# EAGLE design hrem (EAGLE 7.6.0)
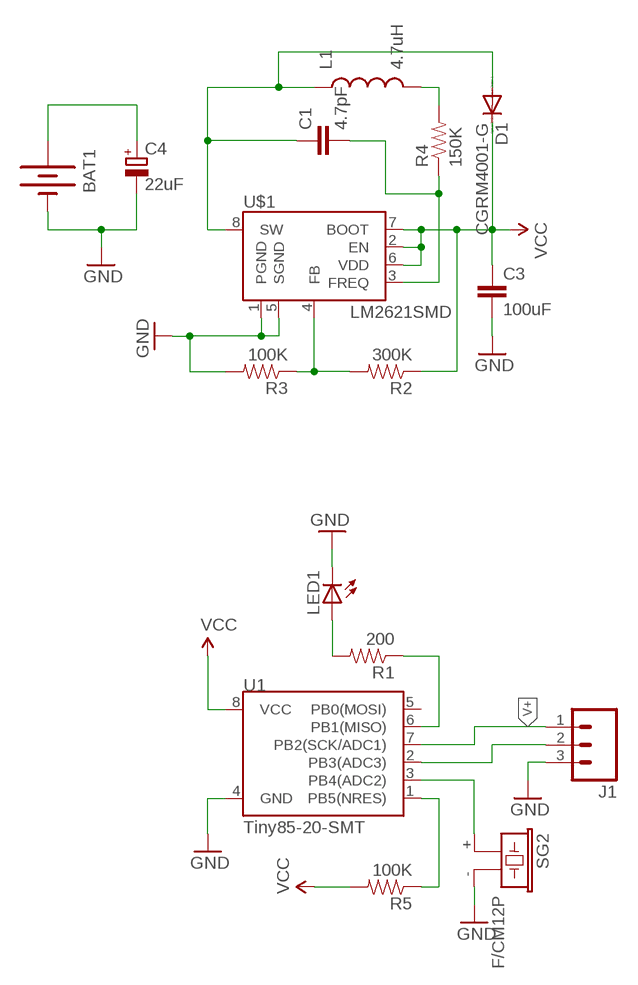
[diagram p0: schematic, sheet 1]

## Parts
BAT1  BATTERYAAA  [BATTERY-AAA]
C1  4.7pF  C-EUC1206  [C1206]
C3  100uF  C-EUC1206  [C1206]
C4  22uF  CPOL-EUE2.5-5  [E2,5-5]
D1  CGRM4001-G  [SOD-123_MINI-SMA]
J1  M03PTH  [1X03]
L1  4.7uH  INDUCTORCR54-47UH  [CR54]
LED1  LED3MM  [LED3MM]
R1  200  RESISTOR1206  [1206]
R2  300K  RESISTOR1206  [1206]
R3  100K  RESISTOR1206  [1206]
R4  150K  RESISTOR1206  [1206]
R5  100K  RESISTOR1206  [1206]
SG2  F/CM12P  [F/CM12P]
U1  Tiny85-20-SMT  ATTINY45TINY85-20-SMT  [SO08-EIAJ]
U$1  LM2621SMD  [MSOP-8]

## Nets
GND: BAT1.GND@1(-) C3.2 C4.- J1.3 LED1.K(C) R3.2 SG2.- U1.4(GND) U$1.1(PGND) U$1.5(SGND)
N$1: LED1.A R1.2
N$2: R5.1 U1.1(PB5(NRES))
N$3: SG2.+ U1.3(PB4(ADC2))
N$5: J1.2 U1.2(PB3(ADC3))
N$8: R1.1 U1.6(PB1(MISO))
N$9: C1.1 D1.A L1.P$1 U$1.8(SW)
N$10: L1.P$2 R4.2
N$11: C1.2 R4.1 U$1.3(FREQ)
N$12: R2.2 R3.1 U$1.4(FB)
N$15: BAT1.PWR@1(+) C4.+
V+: J1.1 U1.7(PB2(SCK/ADC1))
VCC: C3.1 D1.C R2.1 R5.2 U1.8(VCC) U$1.2(EN) U$1.6(VDD) U$1.7(BOOT)
Unconnected: U1.5(PB0(MOSI))

## Library data of the parts
BAT1 = SparkFun-Electromechanical:BATTERY: Battery Holders Various common sizes : AA, AAA, 18650 (PRT-12895), 20mm coin cell and 12mm coin cell. 20MM_4LEGS, BATT-10373; PROD_ID: BATT-08571
C1 C3 = rcl:C-EU: CAPACITOR, European symbol
C4 = rcl:CPOL-EU: POLARIZED CAPACITOR, European symbol
D1 = diode:CGRM400*-G: Molded plasitc,JEDEC SOD-123/Mini SMA Source: Comchip CGRM4001-G.pdf
J1 = SparkFun-Connectors:M03: Header 3 Standard 3-pin 0.1" header. Use with straight break away headers (SKU : PRT-00116), right angle break away headers (PRT-00553), swiss pins (PRT-00743), machine pins (PRT-00117), and female headers (PRT-00115). Molex polarized connector foot print use with SKU : PRT-08232 with associated crimp pins and housings.
L1 = SparkFun-Passives:INDUCTOR: Inductors Basic Inductor/Choke - 0603 and 1206. Footprints are not proven and vary greatly between part numbers. INDUCTOR POWER 3.3UH 4.0A SMD 0.197" L x 0.197" W x 0.177" H (5.00mm x 5.00mm x 4.50mm); PROD_ID: NDUC-10789; VALUE: 47uH
LED1 = led:LED: LED OSRAM: - CHIPLED LG R971, LG N971, LY N971, LG Q971, LY Q971, LO R971, LY R971 LH N974, LH R974 LS Q976, LO Q976, LY Q976 LO Q996 - Hyper CHIPLED LW Q18S LB Q993, LB Q99A, LB R99A - SideLED LS A670, LO A670, LY A670, LG A670, LP A670 LB A673, LV A673, LT A673, LW A673 LH A674 LY A675 LS A676, LA A676, LO A676, LY A676, LW A676 LS A679, LY A679, LG A679 - Hyper Micro SIDELED® LS Y876, LA Y876, LO Y876, LY Y876 LT Y87S - SmartLED LW L88C, LW L88S LB L89C, LB L89S, LG L890 LS L89K, LO L89K, LY L89K LS L896, LA L896, LO L896, LY L896 - TOPLED LS T670, LO T670, LY T670, LG T670, LP T670 LSG T670, LSP T670, LSY T670, LOP T670, LYG T670 LG T671, LOG T671, LSG T671 LB T673, LV T673, LT T673, LW T673 LH T674 LS T676, LA T676, LO T676, LY T676, LB T676, LH T676, LSB T676, LW T676 LB T67C, LV T67C, LT T67C, LS T67K, LO T67K, LY T67K, LW E67C LS E67B, LA E67B, LO E67B, LY E67B, LB E67C, LV E67C, LT E67C LW T67C LS T679, LY T679, LG T679 LS T770, LO T770, LY T770, LG T770, LP T770 LB T773, LV T773, LT T773, LW T773 LH T774 LS E675, LA E675, LY E675, LS T675 LS T776, LA T776, LO T776, LY T776, LB T776 LHGB T686 LT T68C, LB T68C - Hyper Mini TOPLED® LB M676 - Mini TOPLED Santana® LG M470 LS M47K, LO M47K, LY M47K Source: http://www.osram.convergy.de LUXEON: - LUMILED® LXK2-PW12-R00, LXK2-PW12-S00, LXK2-PW14-U00, LXK2-PW14-V00 LXK2-PM12-R00, LXK2-PM12-S00, LXK2-PM14-U00 LXK2-PE12-Q00, LXK2-PE12-R00, LXK2-PE12-S00, LXK2-PE14-T00, LXK2-PE14-U00 LXK2-PB12-K00, LXK2-PB12-L00, LXK2-PB12-M00, LXK2-PB14-N00, LXK2-PB14-P00, LXK2-PB14-Q00 LXK2-PR12-L00, LXK2-PR12-M00, LXK2-PR14-Q00, LXK2-PR14-R00 LXK2-PD12-Q00, LXK2-PD12-R00, LXK2-PD12-S00 LXK2-PH12-R00, LXK2-PH12-S00 LXK2-PL12-P00, LXK2-PL12-Q00, LXK2-PL12-R00 Source: www.luxeon.com KINGBRIGHT: KA-3528ASYC Source: www.kingbright.com
R1-R5 = SparkFun-Resistors:RESISTOR: Resistor Basic schematic elements and footprints for 0603, 1206, and PTH resistors.
SG2 = buzzer:F/CM12P: BUZZER Source: Buerklin; OC_FARNELL: unknown; OC_NEWARK: unknown
U1 = SparkFun-DigitalIC:ATTINY45: Atmel 8-pin 2/4/8kB flash uC; PROD_ID: IC-09092
U$1 = SparkFun-PowerIC:LM2621: Step-up switching regulator IC

## Net classes
0 default: width 0.762 mm, clearance 0.381 mm

## Board
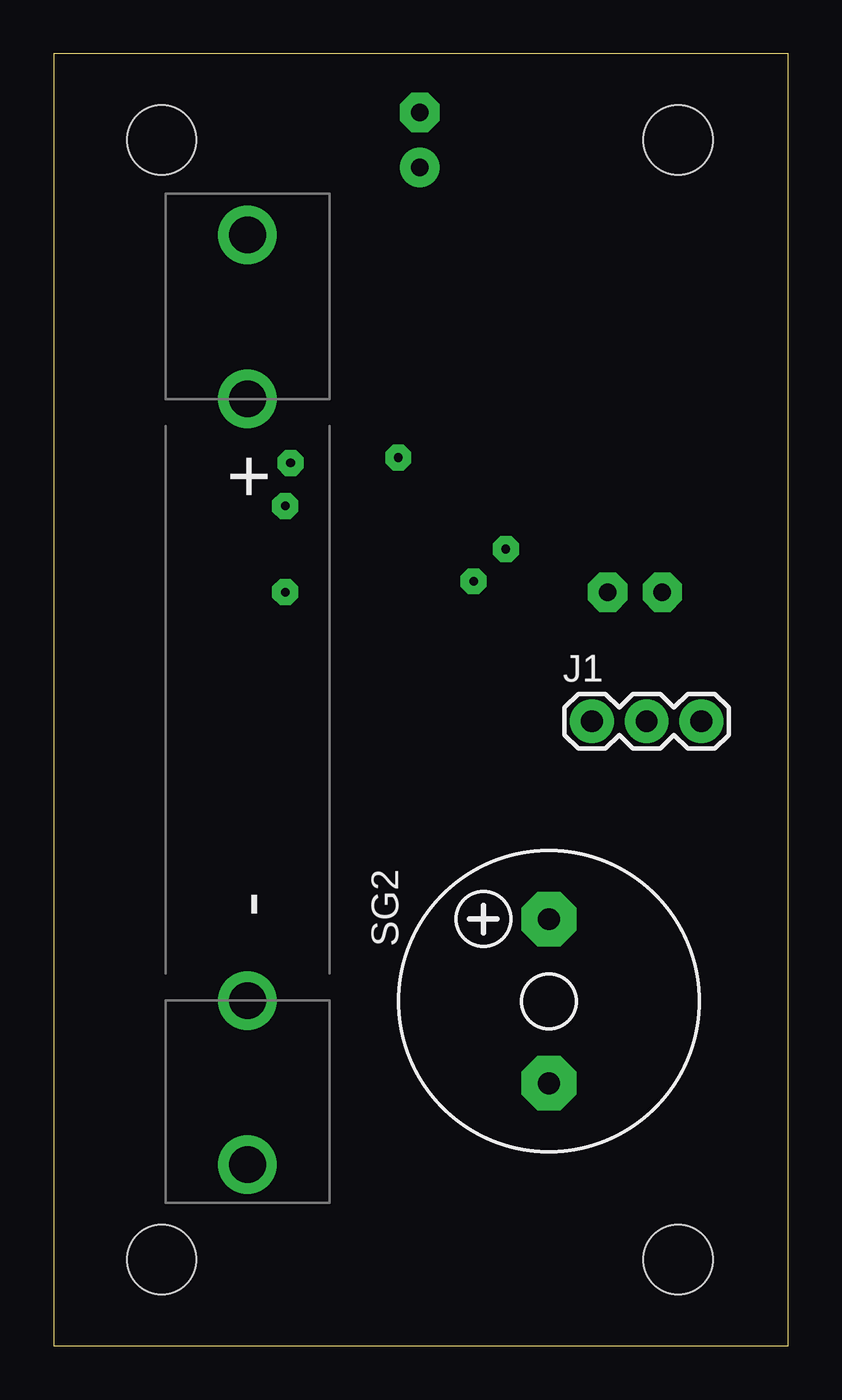
[diagram p1: board, top side]
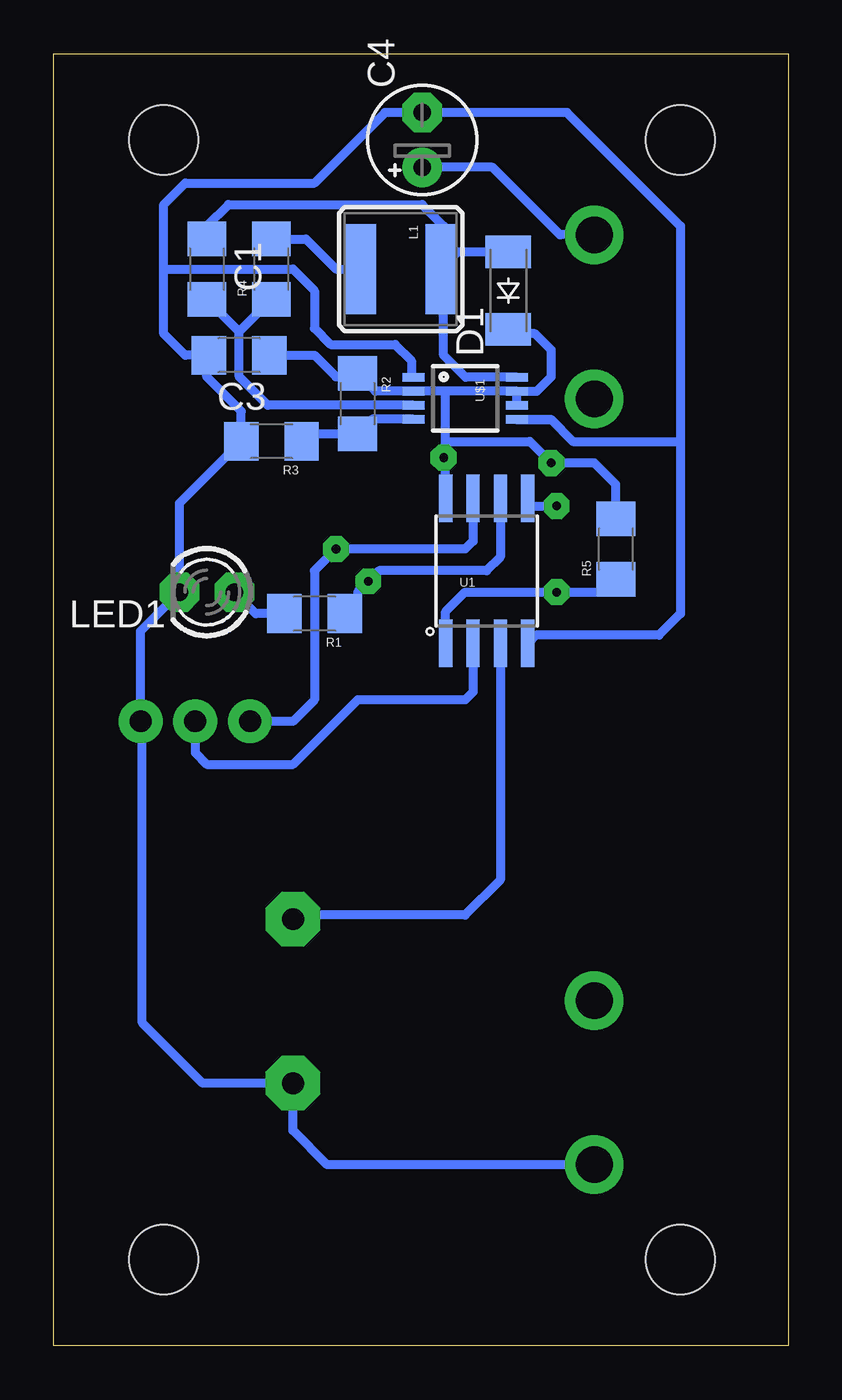
[diagram p2: board, bottom side, seen from below]

Size 34.11 x 60 mm. Coordinates in mm from the lower left corner, seen from the top.
Outline: 0,0 34.11,0 34.11,60 0,60 0,0
Copper layers (1*16): Top 0.035mm / dielectric 1.5mm / Bottom 0.035mm
Design rules "default *": minimum track width 15mil, minimum drill 24mil, track to track 10mil, track to pad 10mil, pad to pad 10mil, via to via 10mil, smd to smd 10mil, copper to edge 40mil, drill to drill 8mil, minimum pad ring 10mil, minimum via ring 8mil, stop-mask expansion 4mil, vias tented up to drill 0mil, thermal gap 10mil
Holes 3.2 mm at 5,4 29,4 5,56 29,56

### Footprints (pad centres in the part's own frame; a part is rotated, then mirrored left to right if it is on the bottom)
BATTERY-AAA = drill 1.702: GND@1 21.59,0; GND@2 13.97,0; PWR@1 -21.59,0; PWR@2 -13.97,0
C1206 = smd 1.6 x 1.8: 1 -1.4,0; 2 1.4,0
E2,5-5 = drill 0.813 pad 1.6: + -1.27,0 | drill 0.813 pad 1.6 octagon: - 1.27,0
SOD-123_MINI-SMA = smd 1.5 x 2.1: A 1.8,0; C -1.8,0
1X03 = drill 1.016 pad 1.88: 1 0,0; 2 2.54,0; 3 5.08,0
CR54 = smd 4.2 x 1.4: P$1 0,1.85; P$2 0,-1.85
LED3MM = drill 0.813 octagon: A -1.27,0; K 1.27,0
1206 = smd 1.6 x 1.8: 1 -1.4,0; 2 1.4,0
F/CM12P = drill 1.016 pad 2.54 octagon: + 3.81,0; - -3.81,0
SO08-EIAJ = smd 0.61 x 2.21: 1 -1.905,-3.378; 2 -0.635,-3.378; 3 0.635,-3.378; 4 1.905,-3.378; 5 1.905,3.353; 6 0.635,3.353; 7 -0.635,3.353; 8 -1.905,3.353
MSOP-8 = smd 0.41 x 1.02: 1 -0.975,-2.4; 2 -0.325,-2.4; 3 0.325,-2.4; 4 0.975,-2.4; 5 0.975,2.4; 6 0.325,2.4; 7 -0.325,2.4; 8 -0.975,2.4

### Placement (x,y rotation side)
BAT1  9,30 270 top
C1  27,50 270 bottom
C3  25.5,46 180 bottom
C4  17,56 90 bottom
D1  13,49 90 bottom
J1  25,29 0 top
L1  18,50 270 bottom
LED1  27,35 180 bottom
R1  22,34 180 bottom
R2  20,43.75 270 bottom
R3  24,42 180 bottom
R4  24,50 90 bottom
R5  8,37 90 bottom
SG2  23,16 90 top
U1  14,36 0 bottom
U$1  15,44 270 bottom

### Tracks (layer width: path | path; a pad name or v marks a point on that pad's centre or on a via)
GND
  Bottom 0.406: BAT1.GND@1 21.41,8.41 23,10 SG2.- 27.19,12.19 30,15 30,28.92 J1.3 30.08,33.19 LED1.K 28.27,39.13 R3.2 25.4,43.4 27,45 27,45.9 | 11,43 12.57,43 U$1.5 11.03,43.02 10,42 5,42 | 27,45.9 C3.2 | 27,45.9 27,46 28,46 29,47 29,50 | 29,50 23,50 22,49 22,47.25 21.25,46.5 18.25,46.5 17.5,45.75 17.5,45.08 U$1.1 | 29,50 29,53 28,54 22,54 18.73,57.27 C4.- 10.27,57.27 5,52 5,42 | 5,42 5,34 6,33 11.72,33 U1.4
N$1
  Bottom 0.406: R1.2 24.73,34 LED1.A
N$2  (via drill 0.4)
  Bottom 0.406: U1.1 15.9,34.09 15,35 v10.75,35 8.6,35 R5.1
N$3
  Bottom 0.406: U1.3 13.37,21.64 15,20 22.81,20 SG2.+
N$4  (via drill 0.4)
  other vias: 16,41.25
N$5
  Bottom 0.406: U1.2 14.63,30.36 15,30 20,30 23,27 27,27 27.54,27.54 J1.2
N$6  (via drill 0.4)
  Bottom 0.406: 12,39 v10.75,39
N$8  (via drill 0.4)
  Bottom 0.406: U1.6 13.37,36.63 14,36 19,36 v19.5,35.5 20,35 20,34.6 R1.1
N$9
  Bottom 0.406: C1.1 27,52 26,53 17,53 16,52 16,50.15 L1.P$1 | D1.A 15.35,50.8 L1.P$1 | U$1.8 14.97,44.98 16,46 16,49.85 L1.P$1
N$10
  Bottom 0.406: R4.2 22.4,51.4 21,50 L1.P$2
N$11
  Bottom 0.406: U$1.3 24.18,43.67 25.5,45 25.5,47.1 | 25.5,47.1 R4.1 | 25.5,47.1 C1.2
N$12
  Bottom 0.406: U$1.4 19.32,43.02 R2.2 22.25,42.35 R3.1
N$15
  Bottom 0.406: BAT1.PWR@1 10.59,51.59 13.73,54.73 C4.+
V+  (via drill 0.4)
  Bottom 0.406: U1.7 14.63,37.37 15,37 v21,37 22,36 22,30 23,29 J1.1
VCC  (via drill 0.4)
  Bottom 0.406: U$1.6 U$1.7 | U$1.7 16,44.33 | 16,44.33 U$1.2 19.18,44.33 R2.1 20.15,45 21,45 22,46 C3.1 | U1.8 15.9,42 | 15.9,42 15.9,44.23 16,44.33 | 10,41 v11,41 | 15.9,42 12,42 v11,41 | U$1.7 11.68,44.33 11,45 11,46.25 11.75,47 12.8,47 D1.C | R5.2 8,40 9,41 v11,41